# EAGLE design controller-traced-bottom (EAGLE 8.3.1)
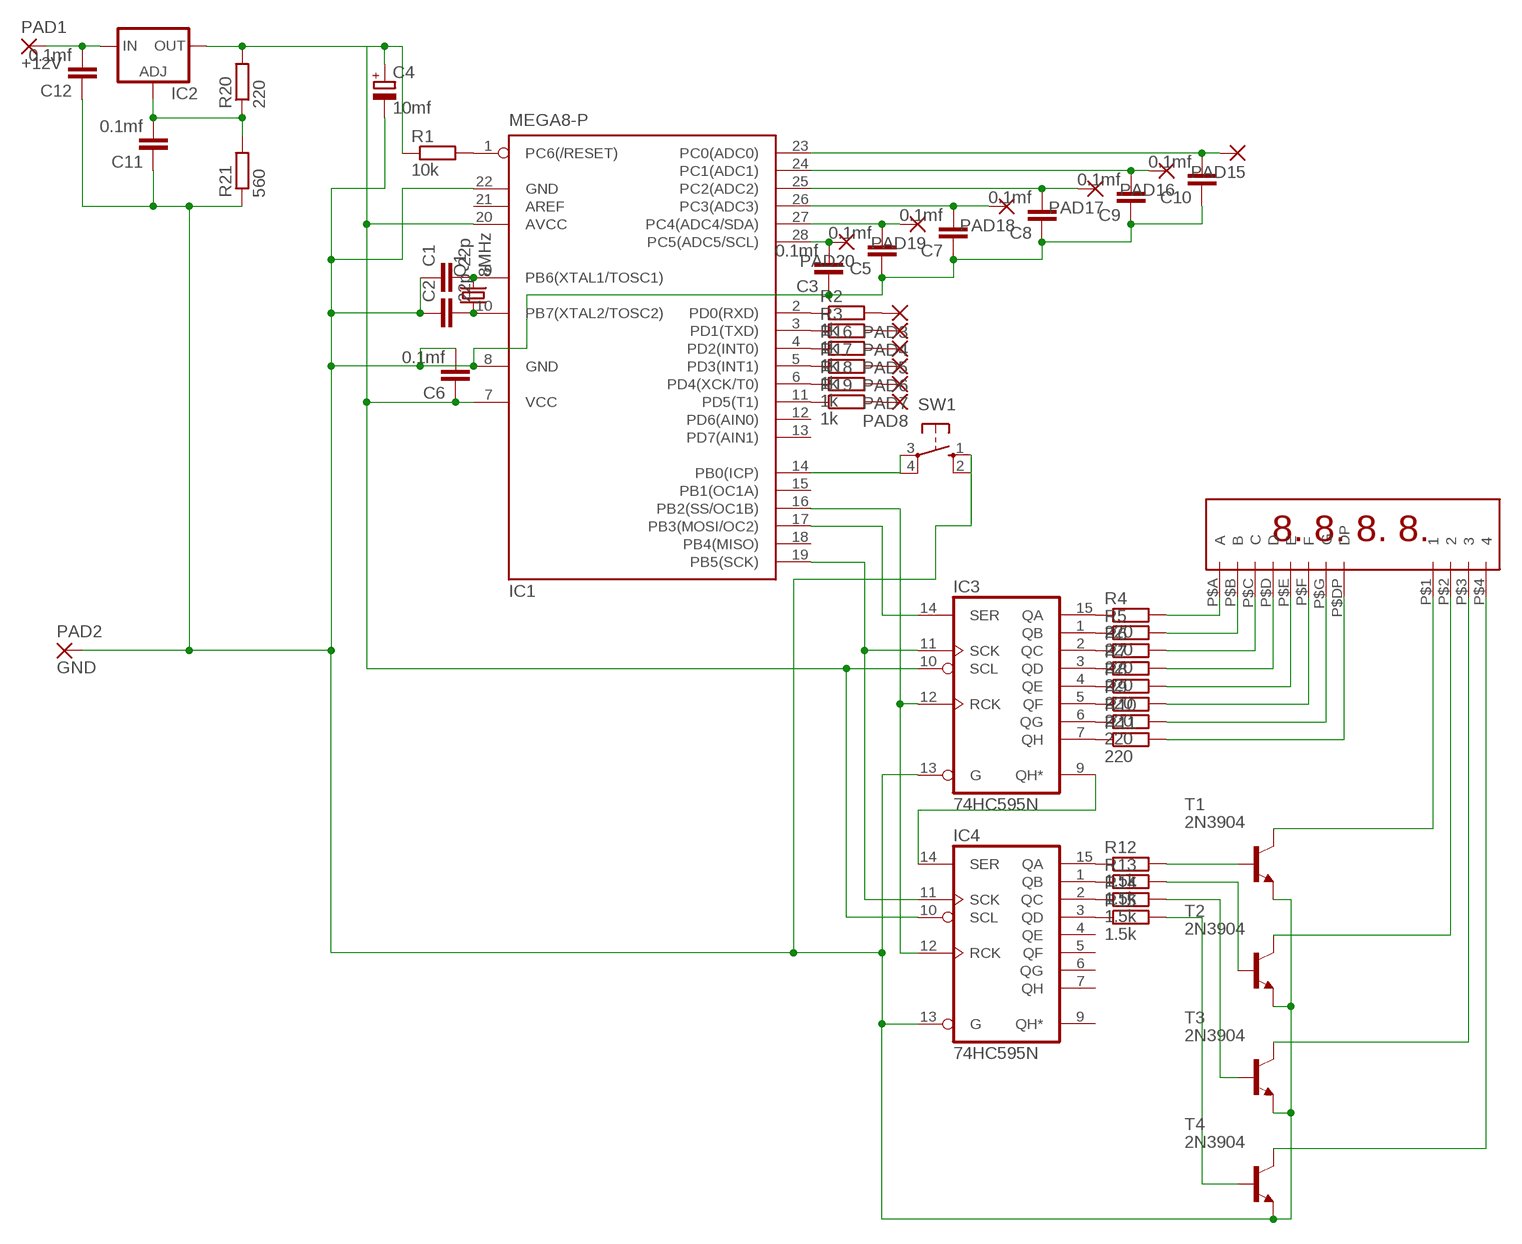
[diagram p0: schematic, sheet 1]

## Parts
C1  22p  C-EU050-024X044  [C050-024X044]
C2  22p  C-EU050-024X044  [C050-024X044]
C3  0.1mf  C-EU050-024X044  [C050-024X044]
C4  10mf  CPOL-EUE1.8-4  [E1,8-4]
C5  0.1mf  C-EU050-024X044  [C050-024X044]
C6  0.1mf  C-EU050-024X044  [C050-024X044]
C7  0.1mf  C-EU050-024X044  [C050-024X044]
C8  0.1mf  C-EU050-024X044  [C050-024X044]
C9  0.1mf  C-EU050-024X044  [C050-024X044]
C10  0.1mf  C-EU050-024X044  [C050-024X044]
C11  0.1mf  C-EU050-024X044  [C050-024X044]
C12  0.1mf  C-EU050-024X044  [C050-024X044]
IC1  MEGA8-P  [DIL28-3]
IC2  LM317TS  [317TS]
IC3  74HC595N  [DIL16]
IC4  74HC595N  [DIL16]
PAD1  +12V  2,54/1,1  [2,54/1,1]
PAD2  GND  2,54/1,1  [2,54/1,1]
PAD3  1,6/0,8  [1,6/0,8]
PAD4  1,6/0,8  [1,6/0,8]
PAD5  1,6/0,8  [1,6/0,8]
PAD6  1,6/0,8  [1,6/0,8]
PAD7  1,6/0,8  [1,6/0,8]
PAD8  1,6/0,8  [1,6/0,8]
PAD15  1,6/0,8  [1,6/0,8]
PAD16  1,6/0,8  [1,6/0,8]
PAD17  1,6/0,8  [1,6/0,8]
PAD18  1,6/0,8  [1,6/0,8]
PAD19  1,6/0,8  [1,6/0,8]
PAD20  1,6/0,8  [1,6/0,8]
Q1  8MHz  CRYSTALHC49S  [HC49/S]
R1  10k  R-EU_0204/7  [0204/7]
R2  1k  R-EU_0204/7  [0204/7]
R3  1k  R-EU_0204/7  [0204/7]
R4  220  R-EU_0204/7  [0204/7]
R5  220  R-EU_0204/7  [0204/7]
R6  220  R-EU_0204/7  [0204/7]
R7  220  R-EU_0204/7  [0204/7]
R8  220  R-EU_0204/7  [0204/7]
R9  220  R-EU_0204/7  [0204/7]
R10  220  R-EU_0204/7  [0204/7]
R11  220  R-EU_0204/7  [0204/7]
R12  1.5k  R-EU_0204/7  [0204/7]
R13  1.5k  R-EU_0204/7  [0204/7]
R14  1.5k  R-EU_0204/7  [0204/7]
R15  1.5k  R-EU_0204/7  [0204/7]
R16  1k  R-EU_0204/7  [0204/7]
R17  1k  R-EU_0204/7  [0204/7]
R18  1k  R-EU_0204/7  [0204/7]
R19  1k  R-EU_0204/7  [0204/7]
R20  220  R-EU_0204/7  [0204/7]
R21  560  R-EU_0204/7  [0204/7]
SW1  10-XX  [B3F-10XX]
T1  2N3904  [TO92]
T2  2N3904  [TO92]
T3  2N3904  [TO92]
T4  2N3904  [TO92]
U$1  KL-5641-ASR  [KL-5641-ASR]

## Nets
N$1: IC1.1(PC6(/RESET)) R1.2
N$2: C4.+ C6.1 IC1.7(VCC) IC1.20(AVCC) IC2.2(OUT) IC3.10(SCL) IC4.10(SCL) R1.1 R20.2
N$3: IC1.2(PD0(RXD)) R2.1
N$4: R4.2 U$1.P$A(A)
N$5: R5.2 U$1.P$B(B)
N$6: IC1.3(PD1(TXD)) R3.1
N$7: C1.2 IC1.9(PB6(XTAL1/TOSC1)) Q1.2
N$8: C2.2 IC1.10(PB7(XTAL2/TOSC2)) Q1.1
N$9: R6.2 U$1.P$C(C)
N$10: R7.2 U$1.P$D(D)
N$11: R8.2 U$1.P$E(E)
N$12: R9.2 U$1.P$F(F)
N$13: IC1.16(PB2(SS/OC1B)) IC3.12(RCK) IC4.12(RCK)
N$14: IC1.17(PB3(MOSI/OC2)) IC3.14(SER)
N$15: IC1.19(PB5(SCK)) IC3.11(SCK) IC4.11(SCK)
N$16: IC3.9(QH*) IC4.14(SER)
N$17: R10.2 U$1.P$G(G)
N$18: R11.2 U$1.P$DP(DP)
N$19: IC3.15(QA) R4.1
N$20: IC3.1(QB) R5.1
N$21: IC3.2(QC) R6.1
N$22: IC3.3(QD) R7.1
N$23: IC3.4(QE) R8.1
N$24: IC3.5(QF) R9.1
N$25: IC3.6(QG) R10.1
N$26: IC3.7(QH) R11.1
N$27: IC4.15(QA) R12.1
N$28: IC4.1(QB) R13.1
N$29: IC4.2(QC) R14.1
N$30: IC4.3(QD) R15.1
N$31: R12.2 T1.2(B)
N$32: R13.2 T2.2(B)
N$33: R14.2 T3.2(B)
N$34: R15.2 T4.2(B)
N$35: C1.1 C2.1 C3.1 C4.- C5.1 C6.2 C7.1 C8.1 C9.1 C10.1 C11.1 C12.1 IC1.8(GND) IC1.22(GND) IC3.13(G) IC4.13(G) PAD2.1(P) R21.1 SW1.1(S) SW1.2(S1) T1.3(E) T2.3(E) T3.3(E) T4.3(E)
N$36: T1.1(C) U$1.P$1
N$39: T4.1(C) U$1.P$4
N$40: C10.2 IC1.23(PC0(ADC0)) PAD15.1(P)
N$41: C9.2 IC1.24(PC1(ADC1)) PAD16.1(P)
N$42: C8.2 IC1.25(PC2(ADC2)) PAD17.1(P)
N$43: C7.2 IC1.26(PC3(ADC3)) PAD18.1(P)
N$44: C5.2 IC1.27(PC4(ADC4/SDA)) PAD19.1(P)
N$45: C3.2 IC1.28(PC5(ADC5/SCL)) PAD20.1(P)
N$46: IC1.4(PD2(INT0)) R16.1
N$47: IC1.5(PD3(INT1)) R17.1
N$48: IC1.6(PD4(XCK/T0)) R18.1
N$49: IC1.11(PD5(T1)) R19.1
N$50: PAD3.1(P) R2.2
N$51: PAD4.1(P) R3.2
N$52: PAD5.1(P) R16.2
N$53: PAD6.1(P) R17.2
N$54: PAD7.1(P) R18.2
N$55: PAD8.1(P) R19.2
N$56: IC1.14(PB0(ICP)) SW1.3(P) SW1.4(P1)
N$57: C12.2 IC2.3(IN) PAD1.1(P)
N$58: C11.2 IC2.1(ADJ) R20.1 R21.2
N$61: T2.1(C) U$1.P$2
N$62: T3.1(C) U$1.P$3
Unconnected: IC1.12(PD6(AIN0)) IC1.13(PD7(AIN1)) IC1.15(PB1(OC1A)) IC1.18(PB4(MISO)) IC1.21(AREF) IC4.4(QE) IC4.5(QF) IC4.6(QG) IC4.7(QH) IC4.9(QH*)

## Power pins joined to a net without a drawn wire
GND: IC3.8(GND) IC4.8(GND)
VCC: IC3.16(VCC) IC4.16(VCC)

## Library data of the parts
C1-C3 C5-C12 = resistor:C-EU: CAPACITOR, European symbol
C4 = resistor:CPOL-EU: POLARIZED CAPACITOR, European symbol
IC1 = atmel:MEGA8-P: MICROCONTROLLER 8 Kbytes FLASH, 1 kbytes SRAM, 512 bytes EEPROM, USART, 4-channel 10 bit ADC, 2-channel 8 bit ADC Pin compatible with Atmega48, ATMega88, ATMega168 Source: avr.lbr; OC_FARNELL: unknown; OC_NEWARK: unknown
IC2 = v-reg:LM317TS: VOLTAGE REGULATOR
IC3 IC4 = 74xx-eu:74*595: 8-bit SHIFT REGISTER, output latch
PAD1 PAD2 = wirepad:2,54/1,1: THROUGH-HOLE PAD
PAD3-PAD8 PAD15-PAD20 = wirepad:1,6/0,8: THROUGH-HOLE PAD
Q1 = adafruit:CRYSTAL: CRYSTAL; OC_FARNELL: 1667008; OC_NEWARK: unknown
R1-R21 = resistor:R-EU_: RESISTOR, European symbol
SW1 = buttons:10-XX: OMRON SWITCH
T1-T4 = transistor:2N3904: NPN TRANSISTOR
U$1 = mgvc:KL-5641-ASR: Индикатор 4 разряда 0.56" Красный, катод, черный фон KL-5641-ASR

## Board
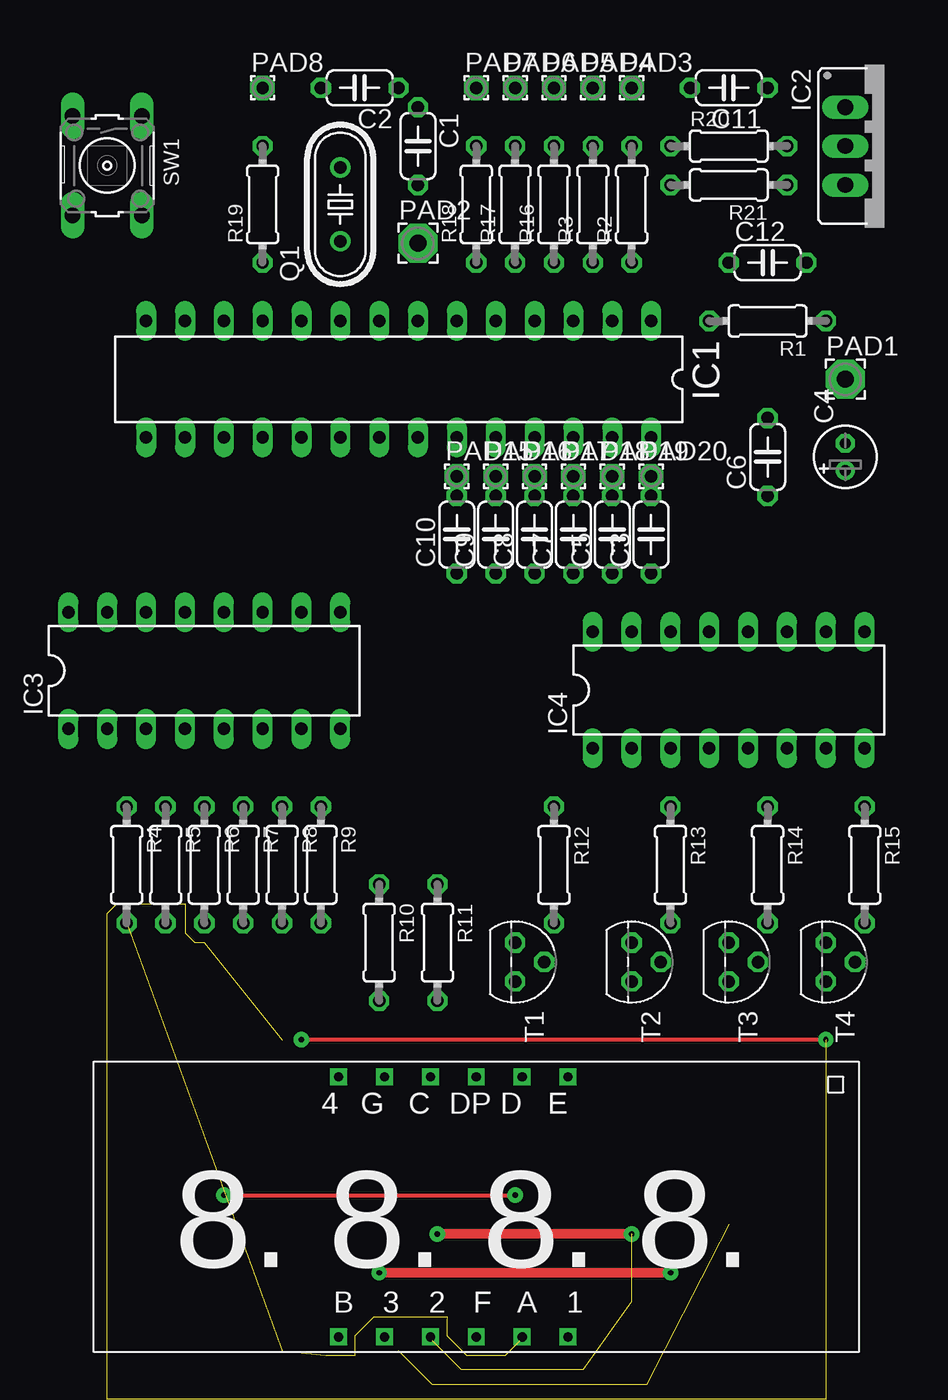
[diagram p1: board, top side]
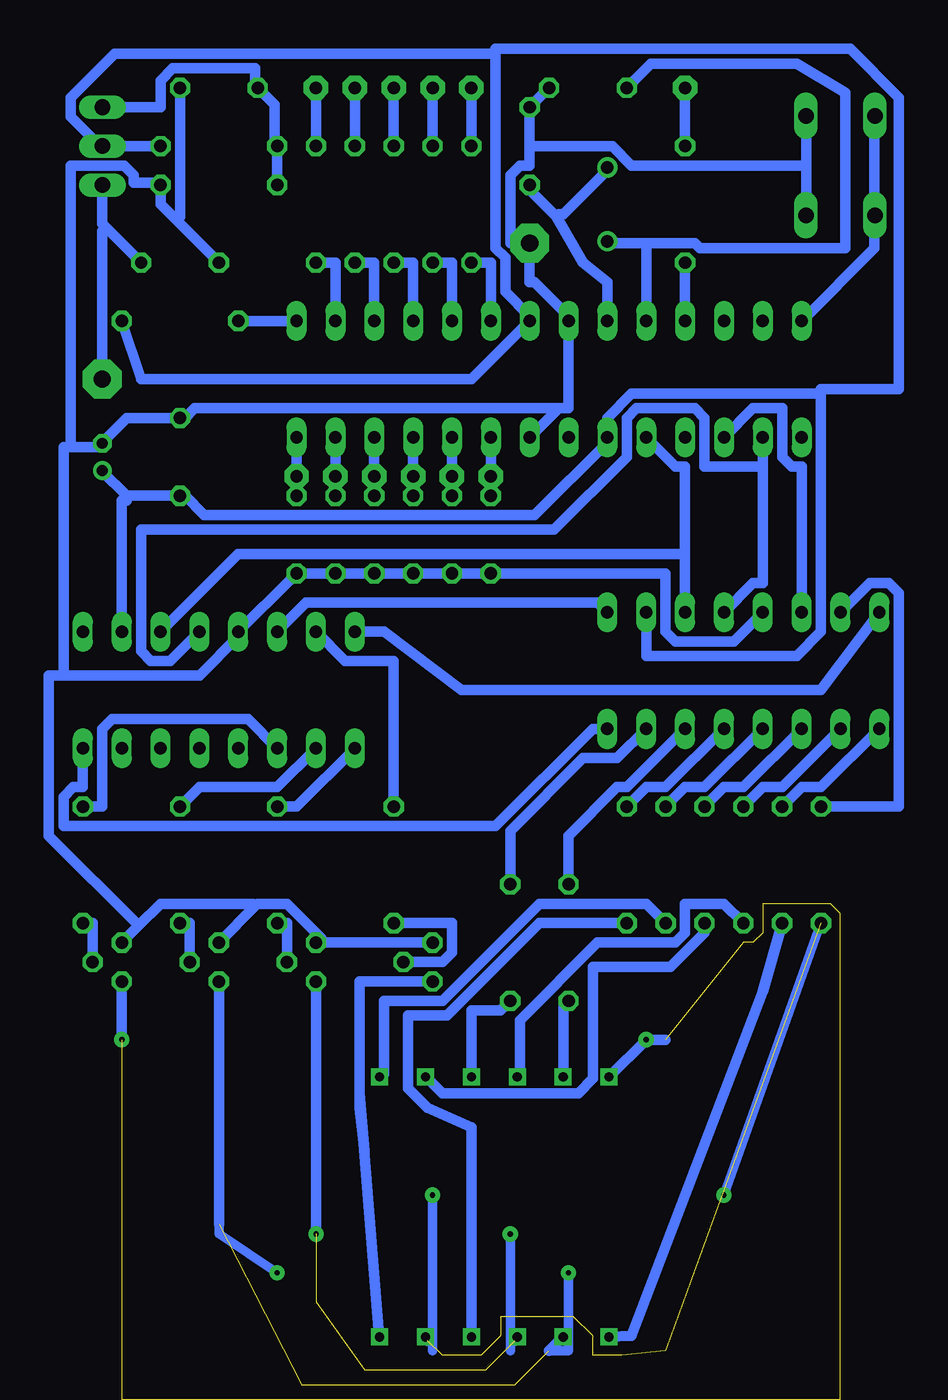
[diagram p2: board, bottom side, seen from below]

No outline drawn. Coordinates in mm, seen from the top.
Copper layers (1*16): Top 0.035mm / dielectric 1.5mm / Bottom 0.035mm
Design rules "default *": minimum track width 0.7mm, minimum drill 0.35mm, track to track 6mil, track to pad 6mil, pad to pad 6mil, via to via 6mil, smd to smd 6mil, copper to edge 40mil, drill to drill 6mil, minimum pad ring 10mil, minimum via ring 8mil, stop-mask expansion 4mil, vias tented up to drill 0mil, thermal gap 10mil

### Footprints (pad centres in the part's own frame; a part is rotated, then mirrored left to right if it is on the bottom)
C050-024X044 = drill 0.813 octagon: 1 -2.54,0; 2 2.54,0
E1,8-4 = drill 0.711 pad 1.168: + -0.889,0 | drill 0.711 pad 1.168 octagon: - 0.889,0
DIL28-3 = drill 0.813 long: 1 -16.51,-3.81; 2 -13.97,-3.81; 3 -11.43,-3.81; 4 -8.89,-3.81; 5 -6.35,-3.81; 6 -3.81,-3.81; 7 -1.27,-3.81; 8 1.27,-3.81; 9 3.81,-3.81; 10 6.35,-3.81; 11 8.89,-3.81; 12 11.43,-3.81; 13 13.97,-3.81; 14 16.51,-3.81; 15 16.51,3.81; 16 13.97,3.81; 17 11.43,3.81; 18 8.89,3.81; 19 6.35,3.81; 20 3.81,3.81; 21 1.27,3.81; 22 -1.27,3.81; 23 -3.81,3.81; 24 -6.35,3.81; 25 -8.89,3.81; 26 -11.43,3.81; 27 -13.97,3.81; 28 -16.51,3.81
317TS = drill 1.016 long: 1 -2.54,-2.54; 2 0,-2.54; 3 2.54,-2.54
DIL16 = drill 0.813 long: 1 -8.89,-3.81; 2 -6.35,-3.81; 3 -3.81,-3.81; 4 -1.27,-3.81; 5 1.27,-3.81; 6 3.81,-3.81; 7 6.35,-3.81; 8 8.89,-3.81; 9 8.89,3.81; 10 6.35,3.81; 11 3.81,3.81; 12 1.27,3.81; 13 -1.27,3.81; 14 -3.81,3.81; 15 -6.35,3.81; 16 -8.89,3.81
2,54/1,1 = drill 1.118 pad 2.54 octagon: 1 0,0
1,6/0,8 = drill 0.813 pad 1.6 octagon: 1 0,0
HC49/S = drill 0.813: 1 -2.413,0; 2 2.413,0
0204/7 = drill 0.813 octagon: 1 -3.81,0; 2 3.81,0
B3F-10XX = drill 1.016 long: 1 -3.251,2.261; 2 3.251,2.261; 3 -3.251,-2.261; 4 3.251,-2.261
TO92 = drill 0.813 octagon: 1 1.27,0; 2 0,1.905; 3 -1.27,0
KL-5641-ASR = drill 0.6 square: P$1 -6,8; P$2 3,8; P$3 6,8; P$4 9,-9; P$A -3,8; P$B 9,8; P$C 3,-9; P$D -3,-9; P$DP 0,-9; P$E -6,-9; P$F 0,8; P$G 6,-9

### Placement (x,y rotation side)
C1  62.23,81.28 270 top
C2  58.42,85.09 180 top
C3  77.47,55.88 90 top
C4  90.17,60.96 90 top
C5  74.93,55.88 90 top
C6  85.09,60.96 90 top
C7  72.39,55.88 90 top
C8  69.85,55.88 90 top
C9  67.31,55.88 90 top
C10  64.77,55.88 90 top
C11  82.55,85.09 180 top
C12  85.09,73.66 0 top
IC1  60.96,66.04 180 top
IC2  92.71,81.28 270 top
IC3  48.26,46.99 0 top
IC4  82.55,45.72 0 top
PAD1  90.17,66.04 0 top
PAD2  62.23,74.93 0 top
PAD3  76.2,85.09 0 top
PAD4  73.66,85.09 0 top
PAD5  71.12,85.09 0 top
PAD6  68.58,85.09 0 top
PAD7  66.04,85.09 0 top
PAD8  52.07,85.09 0 top
PAD15  64.77,59.69 0 top
PAD16  67.31,59.69 0 top
PAD17  69.85,59.69 0 top
PAD18  72.39,59.69 0 top
PAD19  74.93,59.69 0 top
PAD20  77.47,59.69 0 top
Q1  57.15,77.47 90 top
R1  85.09,69.85 180 top
R2  76.2,77.47 90 top
R3  73.66,77.47 90 top
R4  43.18,34.29 270 top
R5  45.72,34.29 270 top
R6  48.26,34.29 270 top
R7  50.8,34.29 270 top
R8  53.34,34.29 270 top
R9  55.88,34.29 270 top
R10  59.69,29.21 270 top
R11  63.5,29.21 270 top
R12  71.12,34.29 270 top
R13  78.74,34.29 270 top
R14  85.09,34.29 270 top
R15  91.44,34.29 270 top
R16  71.12,77.47 90 top
R17  68.58,77.47 90 top
R18  66.04,77.47 90 top
R19  52.07,77.47 90 top
R20  82.55,81.28 0 top
R21  82.55,78.74 180 top
SW1  41.91,80.01 270 top
T1  68.58,27.94 270 top
T2  76.2,27.94 270 top
T3  82.55,27.94 270 top
T4  88.9,27.94 270 top
U$1  66.04,11.43 180 top

### Tracks (layer width: path | path; a pad name or v marks a point on that pad's centre or on a via)
GND
  Bottom 0.7: IC4.8 91.44,39.37 92.08,39.37 92.71,38.73 92.71,36.83 64.45,36.83 58.1,43.18 IC3.8
N$1
  Bottom 0.7: R1.2 IC1.1
N$2
  Bottom 0.7: R1.1 87.63,66.04 66.04,66.04 IC1.7 62.23,70.17 63.82,71.75 63.82,73.98 64.45,74.61 64.45,87.31 | 88.58,58.42 90.17,60.01 C4.+ | 88.58,58.42 C6.1 84.77,58.42 83.5,57.15 61.91,57.15 57.15,61.91 IC1.20 57.15,63.5 55.56,65.09 43.18,65.09 | IC4.10 88.9,58.1 88.58,58.1 88.58,58.42 | IC3.10 54.61,47.94 44.77,47.94 43.18,49.53 43.18,65.09 | 64.45,87.31 64.45,87.63 41.27,87.63 38.1,84.45 38.1,65.41 43.18,65.41 43.18,65.09 | R20.2 IC2.2 90.49,81.44 92.23,83.19 92.23,84.45 89.38,87.31 64.45,87.31
N$3
  Bottom 0.7: IC1.2 74.93,73.66 R2.1
N$4  (via drill 0.35 pad 1)  (10 unrouted)
  Top 0.254: v49.53,12.7 v68.58,12.7
  Bottom 0.61: v68.58,12.7 68.58,2.54 | R4.2 v49.53,12.7
  Bottom 0.7: 68.9,3.17 U$1.P$A
N$5
  Bottom 0.7: R5.2 46.99,26.04 55.56,3.49 U$1.P$B
N$6
  Bottom 0.7: IC1.3 72.39,73.66 R3.1
N$7
  Bottom 0.7: IC1.9 57.15,72.39 58.74,73.66 60.48,76.68 | 60.48,76.68 62.23,78.42 C1.2 | Q1.2 57.15,79.69 60.01,76.83 60.33,76.83 60.48,76.68
N$8
  Bottom 0.7: 54.61,74.93 IC1.10 | 54.61,74.93 57.15,74.93 Q1.1 | C2.2 54.29,86.68 44.77,86.68 41.59,84.77 41.59,74.61 51.12,74.61 51.44,74.93 54.61,74.93
N$9
  Bottom 0.7: R6.2 49.53,31.75 52.07,31.75 52.07,29.84 52.7,29.21 57.78,29.21 62.87,24.13 62.87,20.64 U$1.P$C
N$10
  Bottom 0.7: R7.2 50.8,29.84 53.02,27.62 58.1,27.62 58.1,20.32 59.05,19.37 67.94,19.37 68.9,20.32 U$1.P$D
N$11
  Bottom 0.7: R8.2 54.61,31.75 61.59,31.75 67.94,25.4 71.75,25.4 71.75,20.64 U$1.P$E
N$12
  Bottom 0.7: U$1.P$F 66.04,17.14 68.9,18.41 70.17,19.68 70.17,24.45 67.63,24.45 61.59,30.48 R9.2
N$13
  Bottom 0.7: 46.99,60.33 46.99,52.7 47.62,52.7 IC3.12 | 46.99,60.33 IC1.16 | IC4.12 85.72,47.62 87,47.62 87.63,48.26 87.63,56.2 60.64,56.2 55.88,60.96 55.88,63.5 55.24,64.14 51.44,64.14 50.8,63.5 50.8,60.33 46.99,60.33
N$14
  Bottom 0.7: IC3.14 44.45,60.33 45.09,60.33 45.72,60.96 45.72,64.14 47.62,64.14 IC1.17
N$15
  Bottom 0.7: 52.07,54.61 52.07,60.33 52.7,60.33 IC1.19 | 52.07,54.61 IC3.11 | IC4.11 81.28,54.61 52.07,54.61
N$16
  Bottom 0.7: IC3.9 57.78,51.44 76.83,51.44 IC4.14
N$17
  Bottom 0.7: R10.2 60.01,25.4 60.01,20.64 U$1.P$G
N$18
  Bottom 0.7: U$1.P$DP 66.04,24.77 64.14,24.77 R11.2
N$19
  Bottom 0.7: IC3.15 40.01,52.7 38.73,52.7 38.1,52.07 38.1,38.1 R4.1
N$20
  Bottom 0.7: IC3.1 43.18,39.37 44.45,39.37 R5.1
N$21
  Bottom 0.7: IC3.2 45.72,39.37 46.99,39.37 R6.1
N$22
  Bottom 0.7: IC3.3 48.26,39.37 49.53,39.37 R7.1
N$23
  Bottom 0.7: IC3.4 50.8,39.37 52.07,39.37 R8.1
N$24
  Bottom 0.7: IC3.5 53.34,39.37 54.61,39.37 R9.1
N$25
  Bottom 0.7: IC3.6 55.88,39.37 56.52,39.37 59.69,36.2 R10.1
N$26
  Bottom 0.7: R11.1 63.5,36.51 58.74,41.27 56.52,41.27 IC3.7
N$27
  Bottom 0.7: R12.1 71.12,47.62 74.3,47.62 IC4.15
N$28
  Bottom 0.7: IC4.1 77.47,38.1 R13.1
N$29
  Bottom 0.7: IC4.2 78.74,39.37 83.82,39.37 R14.1
N$30
  Bottom 0.7: IC4.3 80.64,43.81 89.53,43.81 90.17,43.18 90.17,38.1 R15.1
N$31
  Bottom 0.7: T1.2 67.94,27.94 67.31,28.57 67.31,30.48 R12.2
N$32
  Bottom 0.7: T2.2 78.11,30.48 R13.2
N$33
  Bottom 0.7: T3.2 84.45,30.48 R14.2
N$34
  Bottom 0.7: T4.2 90.81,30.48 R15.2
N$35
  Bottom 0.7: T1.3 T2.3 75.88,29.53 78.11,31.75 80.01,31.75 80.17,31.59 | 80.17,31.59 T3.3 | 87.79,30.32 86.36,31.75 80.33,31.75 80.17,31.59 | 87.79,30.32 T4.3 | IC3.13 48.9,48.9 52.7,48.9 53.34,49.53 53.34,53.34 C10.1 C9.1 C8.1 C7.1 C5.1 C3.1 77.47,53.02 77.79,53.02 IC4.13 81.28,49.21 83.82,46.67 92.71,46.67 | 87.79,30.32 93.66,36.2 93.66,46.67 92.71,46.67 | 44.13,80.01 44.13,83.19 SW1.1 | 44.13,80.01 44.13,76.83 SW1.2 | C2.1 C1.1 62.23,81.28 | 62.23,81.28 62.23,80.01 62.87,80.01 63.5,79.38 63.5,74.93 PAD2.1 62.23,72.39 61.91,72.39 59.69,70.17 IC1.8 59.69,64.14 60.33,64.14 | 44.13,80.01 55.56,80.01 56.83,81.28 62.23,81.28 | IC1.22 60.33,64.14 | 60.33,64.14 84.14,64.14 84.77,63.5 C6.2 88.58,63.5 90.17,61.91 C4.- 90.17,61.59 92.23,61.59 | 92.71,46.67 92.71,61.59 92.23,61.59 | 85.33,76.44 86.36,77.47 R21.1 86.68,78.9 88.11,78.9 88.11,79.38 88.74,80.01 92.23,80.01 92.23,61.59 | 85.33,76.44 C12.1 | C11.1 85.09,76.68 85.33,76.44
N$36
  Bottom 0.7: T1.1 73.34,26.67 73.34,18.41 73.03,15.56 73.34,19.37 72.07,3.49 U$1.P$1
N$39  (via drill 0.35 pad 1)  (9 unrouted)
  Top 0.254: v88.9,22.86 v54.61,22.86
  Bottom 0.7: 53.34,22.86 v54.61,22.86 U$1.P$4 | T4.1 v88.9,22.86
N$40
  Bottom 0.7: C10.2 PAD15.1 IC1.23
N$41
  Bottom 0.7: C9.2 PAD16.1 IC1.24
N$42
  Bottom 0.7: C8.2 PAD17.1 IC1.25
N$43
  Bottom 0.7: C7.2 PAD18.1 IC1.26
N$44
  Bottom 0.7: C5.2 PAD19.1 IC1.27
N$45
  Bottom 0.7: C3.2 PAD20.1 IC1.28
N$46
  Bottom 0.7: IC1.4 69.85,73.66 R16.1
N$47
  Bottom 0.7: IC1.5 67.31,73.66 R17.1
N$48
  Bottom 0.7: IC1.6 64.77,73.66 R18.1
N$49
  Bottom 0.7: R19.1 IC1.11
N$50
  Bottom 0.7: PAD3.1 R2.2
N$51
  Bottom 0.7: PAD4.1 R3.2
N$52
  Bottom 0.7: PAD5.1 R16.2
N$53
  Bottom 0.7: PAD6.1 R17.2
N$54
  Bottom 0.7: PAD7.1 R18.2
N$55
  Bottom 0.7: PAD8.1 R19.2
N$56
  Bottom 0.7: IC1.14 39.69,74.61 39.69,76.52 SW1.4 39.69,76.83 39.69,83.19 SW1.3
N$57
  Bottom 0.7: 89.93,75.96 90.17,76.2 IC2.3 | 89.93,75.96 C12.2 | PAD1.1 90.17,75.72 89.93,75.96
N$58
  Bottom 0.7: R21.2 R20.1 78.9,81.6 78.9,83.98 C11.2 80.17,85.41 80.17,86.36 85.57,86.36 86.36,85.57 86.36,83.82 IC2.1
N$61  (via drill 0.35 pad 1)  (4 unrouted)
  Top 0.61: v63.5,10.16 v76.2,10.16
  Bottom 0.61: v63.5,10.16 63.5,2.54
  Bottom 0.7: T2.1 v76.2,10.16 | 63.18,3.17 U$1.P$2
N$62  (via drill 0.35 pad 1)  (3 unrouted)
  Top 0.61: v59.69,7.62 v78.74,7.62
  Bottom 0.61: v59.69,7.62 59.69,2.54 60.96,2.54 | v78.74,7.62 82.55,10.16 82.55,11.43
  Bottom 0.7: 60.96,2.54 60.33,3.17 U$1.P$3 | T3.1 82.55,11.43 82.55,10.79
VCC
  Bottom 0.7: IC3.16 43.18,45.72 66.67,45.72 71.75,49.53 IC4.16